# Altium schematic sheet FPGA_Power_ConnectionSchematic.SchDoc
size A3; SheetNumber: 4; SheetTotal: 10
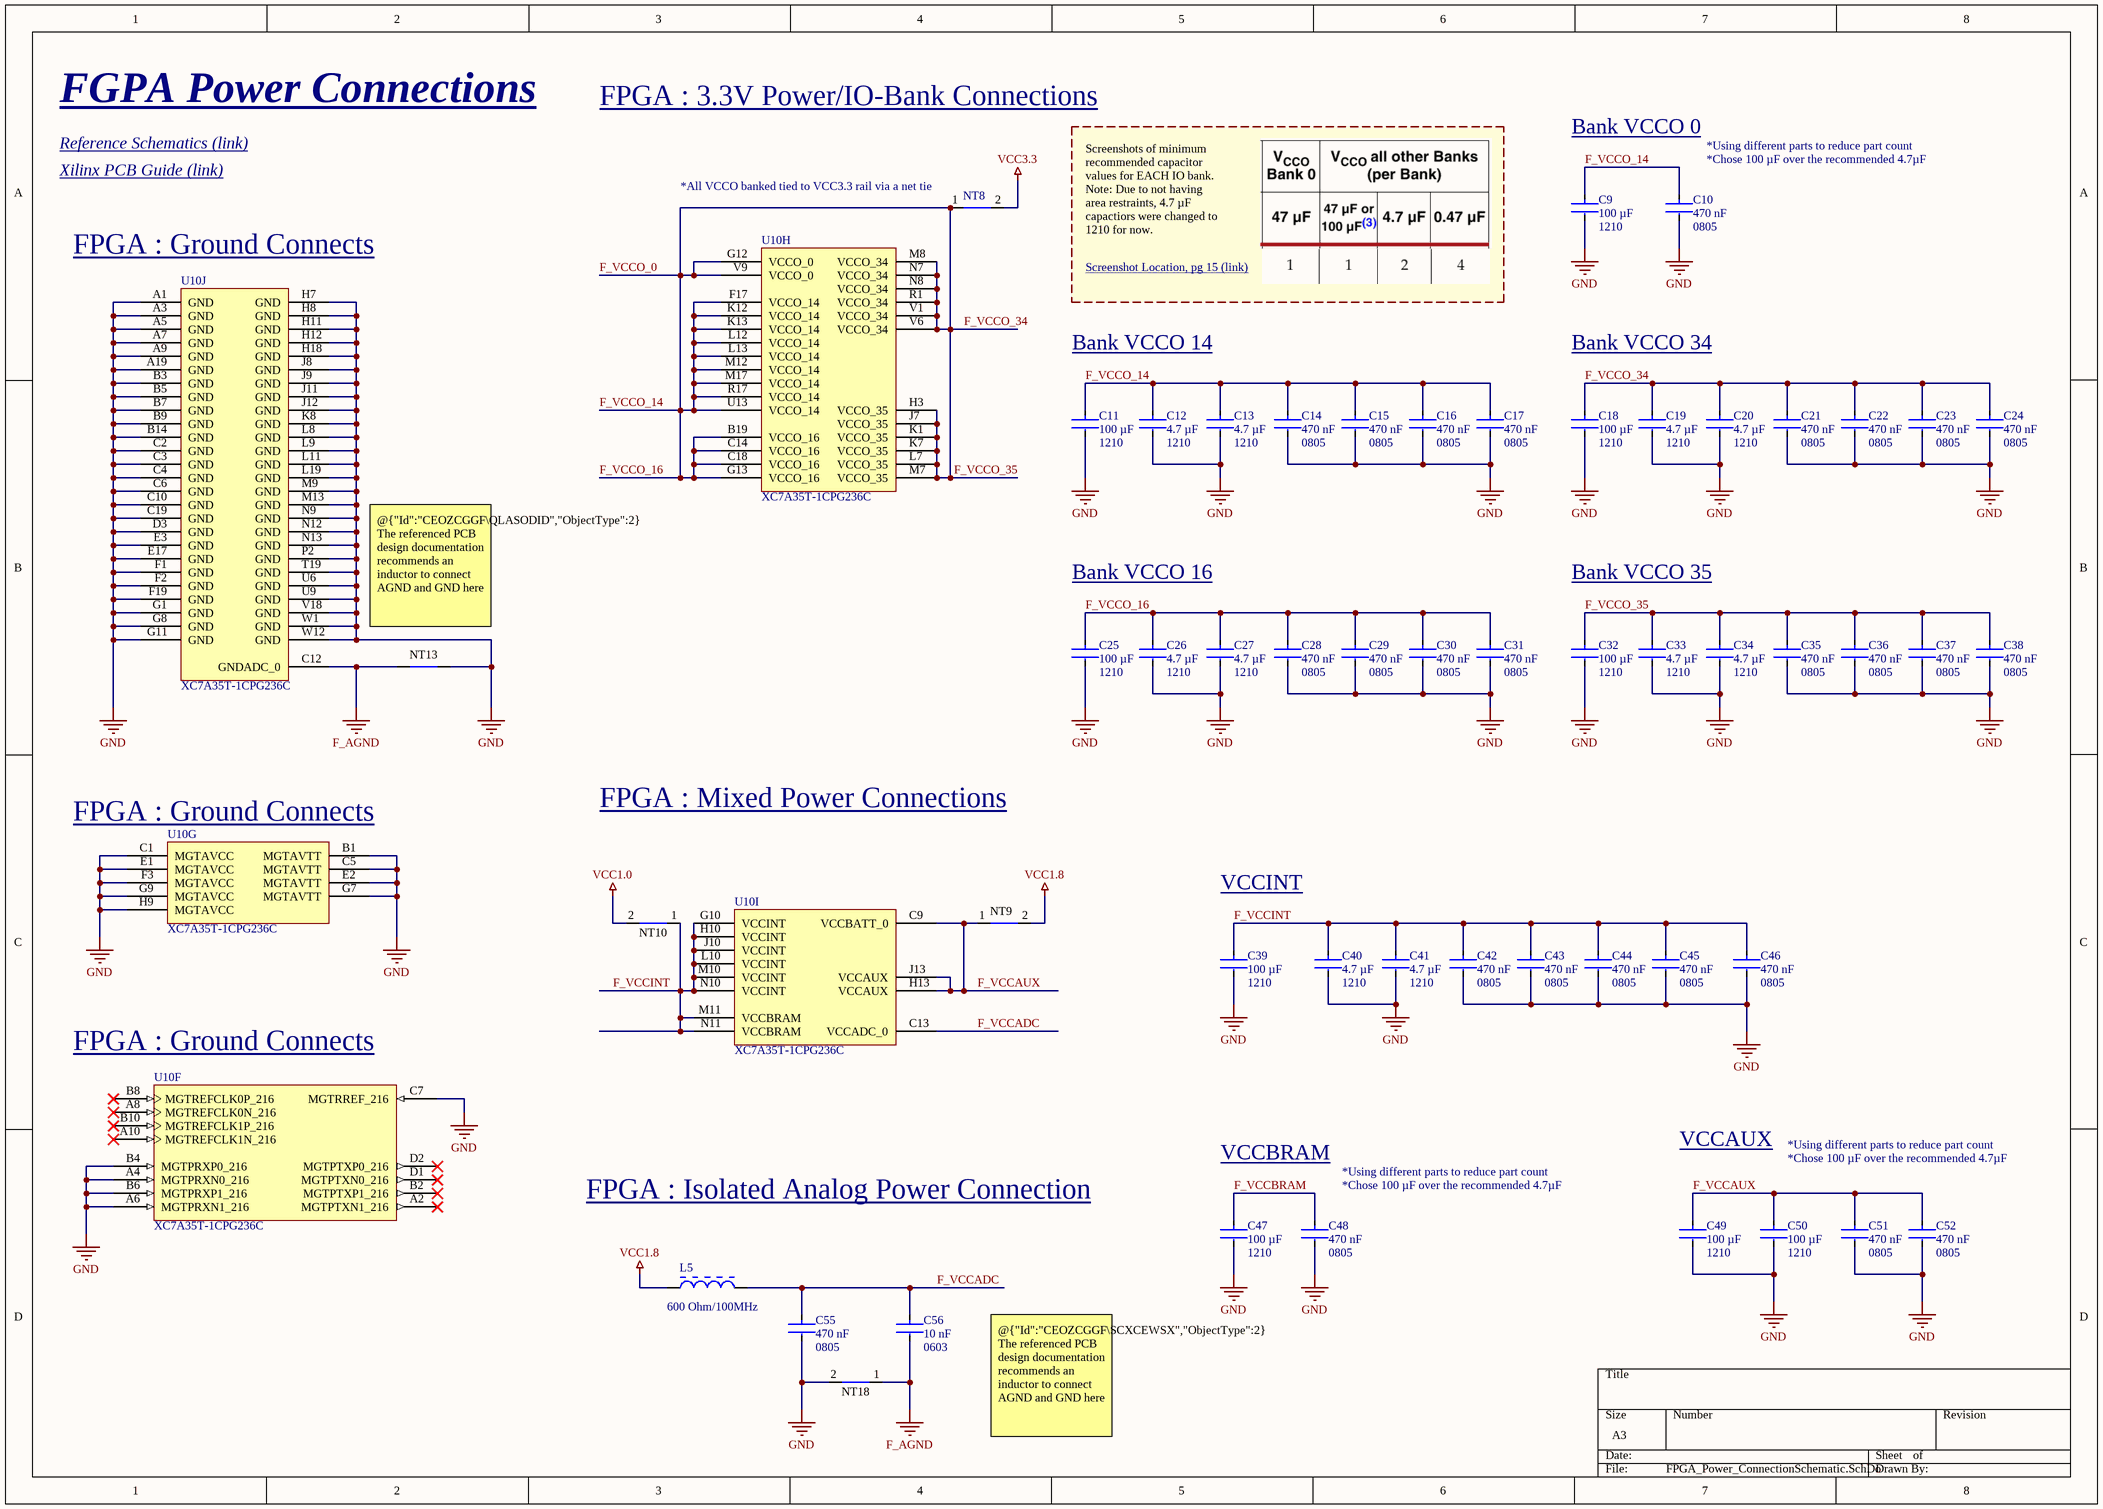
[diagram p0: FPGA_Power_ConnectionSchematic.SchDoc]

## Parts
C9  Case Code (Imperial): 1210  Capacitance: 100 µF  [FP-CL32-IPC_C]  (hidden comment: CL32A107MQVNNNE)
C10  Case Code (Imperial): 0805  Capacitance: 470 nF  [FP-CGA4J-IPC_A]  (hidden comment: CGA4J3X7R1H474M125AE)
C11  Case Code (Imperial): 1210  Capacitance: 100 µF  [FP-CL32-IPC_C]  (hidden comment: CL32A107MQVNNNE)
C12  Case/Package: 1210  Capacitance: 4.7 µF  [FP-1210-L_3_3_0_4-W_2_5_0-IPC_B]  (hidden comment: 12105C475K4Z2A)
C13  Case/Package: 1210  Capacitance: 4.7 µF  [FP-1210-L_3_3_0_4-W_2_5_0-IPC_B]  (hidden comment: 12105C475K4Z2A)
C14  Case Code (Imperial): 0805  Capacitance: 470 nF  [FP-CGA4J-IPC_A]  (hidden comment: CGA4J3X7R1H474M125AE)
C15  Case Code (Imperial): 0805  Capacitance: 470 nF  [FP-CGA4J-IPC_A]  (hidden comment: CGA4J3X7R1H474M125AE)
C16  Case Code (Imperial): 0805  Capacitance: 470 nF  [FP-CGA4J-IPC_A]  (hidden comment: CGA4J3X7R1H474M125AE)
C17  Case Code (Imperial): 0805  Capacitance: 470 nF  [FP-CGA4J-IPC_A]  (hidden comment: CGA4J3X7R1H474M125AE)
C18  Case Code (Imperial): 1210  Capacitance: 100 µF  [FP-CL32-IPC_C]  (hidden comment: CL32A107MQVNNNE)
C19  Case/Package: 1210  Capacitance: 4.7 µF  [FP-1210-L_3_3_0_4-W_2_5_0-IPC_B]  (hidden comment: 12105C475K4Z2A)
C20  Case/Package: 1210  Capacitance: 4.7 µF  [FP-1210-L_3_3_0_4-W_2_5_0-IPC_B]  (hidden comment: 12105C475K4Z2A)
C21  Case Code (Imperial): 0805  Capacitance: 470 nF  [FP-CGA4J-IPC_A]  (hidden comment: CGA4J3X7R1H474M125AE)
C22  Case Code (Imperial): 0805  Capacitance: 470 nF  [FP-CGA4J-IPC_A]  (hidden comment: CGA4J3X7R1H474M125AE)
C23  Case Code (Imperial): 0805  Capacitance: 470 nF  [FP-CGA4J-IPC_A]  (hidden comment: CGA4J3X7R1H474M125AE)
C24  Case Code (Imperial): 0805  Capacitance: 470 nF  [FP-CGA4J-IPC_A]  (hidden comment: CGA4J3X7R1H474M125AE)
C25  Case Code (Imperial): 1210  Capacitance: 100 µF  [FP-CL32-IPC_C]  (hidden comment: CL32A107MQVNNNE)
C26  Case/Package: 1210  Capacitance: 4.7 µF  [FP-1210-L_3_3_0_4-W_2_5_0-IPC_B]  (hidden comment: 12105C475K4Z2A)
C27  Case/Package: 1210  Capacitance: 4.7 µF  [FP-1210-L_3_3_0_4-W_2_5_0-IPC_B]  (hidden comment: 12105C475K4Z2A)
C28  Case Code (Imperial): 0805  Capacitance: 470 nF  [FP-CGA4J-IPC_A]  (hidden comment: CGA4J3X7R1H474M125AE)
C29  Case Code (Imperial): 0805  Capacitance: 470 nF  [FP-CGA4J-IPC_A]  (hidden comment: CGA4J3X7R1H474M125AE)
C30  Case Code (Imperial): 0805  Capacitance: 470 nF  [FP-CGA4J-IPC_A]  (hidden comment: CGA4J3X7R1H474M125AE)
C31  Case Code (Imperial): 0805  Capacitance: 470 nF  [FP-CGA4J-IPC_A]  (hidden comment: CGA4J3X7R1H474M125AE)
C32  Case Code (Imperial): 1210  Capacitance: 100 µF  [FP-CL32-IPC_C]  (hidden comment: CL32A107MQVNNNE)
C33  Case/Package: 1210  Capacitance: 4.7 µF  [FP-1210-L_3_3_0_4-W_2_5_0-IPC_B]  (hidden comment: 12105C475K4Z2A)
C34  Case/Package: 1210  Capacitance: 4.7 µF  [FP-1210-L_3_3_0_4-W_2_5_0-IPC_B]  (hidden comment: 12105C475K4Z2A)
C35  Case Code (Imperial): 0805  Capacitance: 470 nF  [FP-CGA4J-IPC_A]  (hidden comment: CGA4J3X7R1H474M125AE)
C36  Case Code (Imperial): 0805  Capacitance: 470 nF  [FP-CGA4J-IPC_A]  (hidden comment: CGA4J3X7R1H474M125AE)
C37  Case Code (Imperial): 0805  Capacitance: 470 nF  [FP-CGA4J-IPC_A]  (hidden comment: CGA4J3X7R1H474M125AE)
C38  Case Code (Imperial): 0805  Capacitance: 470 nF  [FP-CGA4J-IPC_A]  (hidden comment: CGA4J3X7R1H474M125AE)
C39  Case Code (Imperial): 1210  Capacitance: 100 µF  [FP-CL32-IPC_C]  (hidden comment: CL32A107MQVNNNE)
C40  Case/Package: 1210  Capacitance: 4.7 µF  [FP-1210-L_3_3_0_4-W_2_5_0-IPC_B]  (hidden comment: 12105C475K4Z2A)
C41  Case/Package: 1210  Capacitance: 4.7 µF  [FP-1210-L_3_3_0_4-W_2_5_0-IPC_B]  (hidden comment: 12105C475K4Z2A)
C42  Case Code (Imperial): 0805  Capacitance: 470 nF  [FP-CGA4J-IPC_A]  (hidden comment: CGA4J3X7R1H474M125AE)
C43  Case Code (Imperial): 0805  Capacitance: 470 nF  [FP-CGA4J-IPC_A]  (hidden comment: CGA4J3X7R1H474M125AE)
C44  Case Code (Imperial): 0805  Capacitance: 470 nF  [FP-CGA4J-IPC_A]  (hidden comment: CGA4J3X7R1H474M125AE)
C45  Case Code (Imperial): 0805  Capacitance: 470 nF  [FP-CGA4J-IPC_A]  (hidden comment: CGA4J3X7R1H474M125AE)
C46  Case Code (Imperial): 0805  Capacitance: 470 nF  [FP-CGA4J-IPC_A]  (hidden comment: CGA4J3X7R1H474M125AE)
C47  Case Code (Imperial): 1210  Capacitance: 100 µF  [FP-CL32-IPC_C]  (hidden comment: CL32A107MQVNNNE)
C48  Case Code (Imperial): 0805  Capacitance: 470 nF  [FP-CGA4J-IPC_A]  (hidden comment: CGA4J3X7R1H474M125AE)
C49  Case Code (Imperial): 1210  Capacitance: 100 µF  [FP-CL32-IPC_C]  (hidden comment: CL32A107MQVNNNE)
C50  Case Code (Imperial): 1210  Capacitance: 100 µF  [FP-CL32-IPC_C]  (hidden comment: CL32A107MQVNNNE)
C51  Case Code (Imperial): 0805  Capacitance: 470 nF  [FP-CGA4J-IPC_A]  (hidden comment: CGA4J3X7R1H474M125AE)
C52  Case Code (Imperial): 0805  Capacitance: 470 nF  [FP-CGA4J-IPC_A]  (hidden comment: CGA4J3X7R1H474M125AE)
C55  Case Code (Imperial): 0805  Capacitance: 470 nF  [FP-CGA4J-IPC_A]  (hidden comment: CGA4J3X7R1H474M125AE)
C56  Case Code (Imperial): 0603  Capacitance: 10 nF  [FP-0603-L_1_6_0_1-W_0_8_0-MFG]  (hidden comment: EMK107SD103KA-T)
L5  OhmAtFreq: 600 Ohm/100MHz  [BOUR-SRN3015-2_V]  (hidden comment: SRN3015-3R3M)
NT8  NetTieSMD_2Line  [NetTieSMD_2Line-Footprint-1]  (value not drawn)  (net tie, no BOM)
NT9  NetTieSMD_2Line  [NetTieSMD_2Line-Footprint-1]  (value not drawn)  (net tie, no BOM)
NT10  NetTieSMD_2Line  [NetTieSMD_2Line-Footprint-1]  (value not drawn)  (net tie, no BOM)
NT13  NetTieSMD_2Line  [NetTieSMD_2Line-Footprint-1]  (value not drawn)  (net tie, no BOM)
NT18  NetTieSMD_2Line  [NetTieSMD_2Line-Footprint-1]  (value not drawn)  (net tie, no BOM)
U10  XC7A35T-1CPG236C  [CPG236]  (parts F,G,H,I,J of 10)

## Nets
F_AGND: C56.2 NT13.1 NT18.1 U10.C12(GNDADC_0)
GND: C9.2 C10.2 C11.2 C12.2 C13.2 C14.2 C15.2 C16.2 C17.2 C18.2 C19.2 C20.2 C21.2 C22.2 C23.2 C24.2 C25.2 C26.2 C27.2 C28.2 C29.2 C30.2 C31.2 C32.2 C33.2 C34.2 C35.2 C36.2 C37.2 C38.2 C39.2 C40.2 C41.2 C42.2 C43.2 C44.2 C45.2 C46.2 C47.2 C48.2 C49.2 C50.2 C51.2 C52.2 C55.2 NT13.2 NT18.2 U10.A1(GND) U10.A3(GND) U10.A4(MGTPRXN0_216) U10.A5(GND) U10.A6(MGTPRXN1_216) U10.A7(GND) U10.A9(GND) U10.A19(GND) U10.B1(MGTAVTT) U10.B3(GND) U10.B4(MGTPRXP0_216) U10.B5(GND) U10.B6(MGTPRXP1_216) U10.B7(GND) U10.B9(GND) U10.B14(GND) U10.C1(MGTAVCC) U10.C2(GND) U10.C3(GND) U10.C4(GND) U10.C5(MGTAVTT) U10.C6(GND) U10.C7(MGTRREF_216) U10.C10(GND) U10.C19(GND) U10.D3(GND) U10.E1(MGTAVCC) U10.E2(MGTAVTT) U10.E3(GND) U10.E17(GND) U10.F1(GND) U10.F2(GND) U10.F3(MGTAVCC) U10.F19(GND) U10.G1(GND) U10.G7(MGTAVTT) U10.G8(GND) U10.G9(MGTAVCC) U10.G11(GND) U10.H7(GND) U10.H8(GND) U10.H9(MGTAVCC) U10.H11(GND) U10.H12(GND) U10.H18(GND) U10.J8(GND) U10.J9(GND) U10.J11(GND) U10.J12(GND) U10.K8(GND) U10.L8(GND) U10.L9(GND) U10.L11(GND) U10.L19(GND) U10.M9(GND) U10.M13(GND) U10.N9(GND) U10.N12(GND) U10.N13(GND) U10.P2(GND) U10.T19(GND) U10.U6(GND) U10.U9(GND) U10.V18(GND) U10.W1(GND) U10.W12(GND)
VCC1.0: NT10.2
VCC1.8: L5.2 NT9.2
VCC3.3: NT8.2
F_VCCADC: C55.1 C56.1 L5.1 U10.C13(VCCADC_0)
F_VCCAUX: C49.1 C50.1 C51.1 C52.1 NT9.1 U10.C9(VCCBATT_0) U10.H13(VCCAUX) U10.J13(VCCAUX)
F_VCCBRAM: C47.1 C48.1
F_VCCINT: C39.1 C40.1 C41.1 C42.1 C43.1 C44.1 C45.1 C46.1 NT10.1 U10.G10(VCCINT) U10.H10(VCCINT) U10.J10(VCCINT) U10.L10(VCCINT) U10.M10(VCCINT) U10.M11(VCCBRAM) U10.N10(VCCINT) U10.N11(VCCBRAM)
F_VCCO_0: C9.1 C10.1 C11.1 C12.1 C13.1 C14.1 C15.1 C16.1 C17.1 C18.1 C19.1 C20.1 C21.1 C22.1 C23.1 C24.1 C25.1 C26.1 C27.1 C28.1 C29.1 C30.1 C31.1 C32.1 C33.1 C34.1 C35.1 C36.1 C37.1 C38.1 NT8.1 U10.B19(VCCO_16) U10.C14(VCCO_16) U10.C18(VCCO_16) U10.F17(VCCO_14) U10.G12(VCCO_0) U10.G13(VCCO_16) U10.H3(VCCO_35) U10.J7(VCCO_35) U10.K1(VCCO_35) U10.K7(VCCO_35) U10.K12(VCCO_14) U10.K13(VCCO_14) U10.L7(VCCO_35) U10.L12(VCCO_14) U10.L13(VCCO_14) U10.M7(VCCO_35) U10.M8(VCCO_34) U10.M12(VCCO_14) U10.M17(VCCO_14) U10.N7(VCCO_34) U10.N8(VCCO_34) U10.R1(VCCO_34) U10.R17(VCCO_14) U10.U13(VCCO_14) U10.V1(VCCO_34) U10.V6(VCCO_34) U10.V9(VCCO_0)  [also labelled F_VCCO_14, F_VCCO_16, F_VCCO_34, F_VCCO_35]

Not connected (* = marked no-connect by the designer): U10 A2(MGTPTXN1_216)* A8(MGTREFCLK0N_216)* A10(MGTREFCLK1N_216)* B2(MGTPTXP1_216)* B8(MGTREFCLK0P_216)* B10(MGTREFCLK1P_216)* D1(MGTPTXN0_216)* D2(MGTPTXP0_216)*

## Notes on the sheet
- FGPA Power Connections
- FPGA : 3.3V Power/IO-Bank Connections
- Reference Schematics (link) <https://digilent.com/reference/_media/reference/programmable-logic/cmod-a7/cmod_a7_sch_rev_c0.pdf?_gl=1*m8eg3n*_gcl_au*MjAxOTQ5MDM5OS4xNzQ2MzA4ODg3*_ga*MTA3MTgyNDA3MS4xNzQ0ODY4ODUx*_ga_JSPEFFCPBT*czE3NDY1MDUzMjQkbzIkZzEkdDE3NDY1MDUzMzQkajUwJGwwJGgzMzYwMDM3MjE.>
- Xilinx PCB Guide (link) <https://0x04.net/~mwk/xidocs/ug/xc7-pcb.pdf>
- Bank VCCO 0
- (near C10) *Chose 100 µF over the recommended 4.7µF
- *Using different parts to reduce part count
- (near NT8) *All VCCO banked tied to VCC3.3 rail via a net tie
- Screenshots of minimum recommended capacitor values for EACH IO bank.
  Note: Due to not having area restraints, 4.7 µF capactiors were changed to 1210 for now.
- (near U10) FPGA : Ground Connects
- Screenshot Location, pg 15 (link) <https://0x04.net/~mwk/xidocs/ug/xc7-pcb.pdf>
- Bank VCCO 14
- Bank VCCO 34
- Bank VCCO 16
- Bank VCCO 35
- (near NT13) @{"Id":"CEOZCGGF\QLASODID","ObjectType":2} The referenced PCB design documentation recommends an inductor to connect AGND and GND here
- FPGA : Mixed Power Connections
- VCCINT
- VCCBRAM
- (near C48) *Chose 100 µF over the recommended 4.7µF
- VCCAUX
- *Chose 100 µF over the recommended 4.7µF
- FPGA : Isolated Analog Power Connection
- @{"Id":"CEOZCGGF\SCXCEWSX","ObjectType":2} The referenced PCB design documentation recommends an inductor to connect AGND and GND here

## Library data of the parts
C9 C11 C18 C25 C32 C39 C47 C49 C50 = CMP-13271-001330-1: CAP CER 100UF 6.3V X5R 1210; Tolerance: 20%; Material: Ceramic; Voltage: 6.3V; Voltage Rating (DC): 6.3V; Length: 3.2mm; Width: 0.098inch; Thickness: 0.11inch; Dielectric: X5R; Packaging: Tape and Reel; Voltage Rating: 6.3V; Min Operating Temperature: -55°C; Lead Free: Lead Free; Radiation Hardening: No; Height: 2.5mm; Depth: 2.5mm; Case Code (Metric): 3225; Mount: Surface Mount; Package Quantity: 1; Case/Package: 1210; Max Operating Temperature: 85°C; Contact Plating: Tin
C10 C14-C17 C21-C24 C28-C31 C35-C38 C42-C46 C48 C51 C52 C55 = CMP-08246-001744-1: Cap Ceramic 470nF 50V X7R 20% Pad SMD 0805 +125°C Automotive T/R; Length: 2mm; Depth: 1.25mm; Features: Soft Termination; Case Code (Metric): 2012; Max Operating Temperature: 125°C; Tolerance: 20%; Termination: SMD/SMT; Mount: Surface Mount; Voltage Rating (DC): 50V; Dielectric: X7R; Thickness: 0.049inch; Width: 0.049inch; Min Operating Temperature: -55°C; Packaging: Tape and Reel; Height: 1.25mm; REACH SVHC: No SVHC; Package Quantity: 1; Weight: 0.000194oz; Case/Package: 0805; Ratings: AEC-Q200; Voltage Rating: 50V
C12 C13 C19 C20 C26 C27 C33 C34 C40 C41 = CMP-04427-013061-1: Automotive Ceramic Capacitor, 1210, 4.7uF, 10%, X7R, 15%, 50V; Dissipation Factor: 2.5%; Length: 3.2mm; Termination: SMD/SMT; Height: 2.79mm; Package Quantity: 1; Tolerance: 10%; Lead Free: Lead Free; Max Operating Temperature: 125°C; Number of Pins: 2; Voltage Rating (DC): 50V; Depth: 2.5mm; REACH SVHC: No SVHC; Series: FLEXITERM®; Construction: Flat; RoHS Compliant: Yes; Thickness: 0.11inch; Dielectric: X7R; Width: 0.098inch; Mount: Surface Mount; Packaging: Tape and Reel; Features: Soft Termination; Case Code (Metric): 3225; Voltage Rating: 50V; Case Code (Imperial): 1210; Min Operating Temperature: -55°C; Contact Plating: Tin; Ratings: AEC-Q200; Radiation Hardening: No
C56 = CMP-14477-001835-2: None; Voltage Rating (DC): 16V; Tolerance: 10%; Mount: Surface Mount; Lead Free: Lead Free; Min Operating Temperature: -55°C; Resistor Type: Ceramic; Voltage Rating: 16V; Package Quantity: 1; RoHS Compliant: Yes; Case/Package: 0603; Length: 1.6mm; Radiation Hardening: No; Halogen Free: Halogen Free; Max Operating Temperature: 125°C; Thickness: 0.035inch; Termination: SMD/SMT; Case Code (Metric): 1608; Packaging: Tape and Reel; Weight: 7.1E-05oz; Width: 0.031inch; Construction: Flat; Height: 0.8mm; Depth: 0.8mm; Series: CFCAP™
L5 = CMP-0007-00001-1: Semi-shielded Power Inductor, 3.3 uH, +/- 20%, 1.6 A, -40 to 125 degC, 3 x 3 x 1.5 mm SMD, RoHS and Halogen Free, Tape and Reel; Manufacturer: Bourns; DCR Max: 0.112 Ohm; Resistance to Solder Heat: +260 degC for 10 sec.; Inductance: 3.3 uH; Rated current: 1.6 A; SRF Min: 75 MHz; Isat: 1.4 A; Inductance tolerance: +/- 20%; PackageDescription: 2-Pin SMD, Body 3 x 3 mm, Height 1.5 mm; ComponentLink1URL: http://www.bourns.com/; ComponentLink3URL: http://www.bourns.com/data/global/pdfs/SRN3015.pdf; RoHS: TRUE; ComponentLink2URL: http://www.bourns.com/data/global/pdfs/SRN3015.pdf; DatasheetVersion: Aug-11; ComponentLink3Description: Package Specification; PartNumber: SRN3015-3R3M; ComponentLink2Description: Datasheet; Packing: Tape and Reel; ComponentLink1Description: Manufacturer URL; Mounting Technology: Surface Mount; PackageReference: SRN3015; Operating Temperature: -40 to 125 degC
NT8 = CMP-00028-00008-4: Net tie for a small straigth net tie.
NT9 NT10 NT13 NT18 = CMP-00028-00008-1: Net tie for a small straigth net tie.
U10 = CMP-0383-00006-1: Artix-7 FPGA, 106 User I/Os, 2 GTP, 238-Ball BGA, Speed Grade 1, Commercial Grade, Pb-Free; Manufacturer: Xilinx; CMTs: 5; Total Block RAM: 1800 Kb; Logic Cells: 33280; Speed Grades: 1; GTP: 2; Available User I/O: 106; ComponentLink1URL: http://www.xilinx.com/; Maximum Distributed RAM: 400 Kb; PackageVersion: Rev. 1.11; PartNumber: XC7A35T-1CPG236C; ComponentLink2URL: http://www.xilinx.com/support/documentation/data_sheets/ds180_7Series_Overview.pdf; DatasheetVersion: Rev. 1.15; ComponentLink1Description: Manufacturer URL; ComponentLink3Description: Pinout; ComponentLink4Description: Package Specification; Mounting Technology: Surface Mount; PackageReference: CPG-236; Operating Temperature Range: Commercial; PackageDescription: 238-Ball Wire-Bond Chip-Scale BGA, Body 10 x10 mm, Pitch 0.5 mm; ComponentLink3URL: http://www.xilinx.com/support/documentation/user_guides/ug475_7Series_Pkg_Pinout.pdf; ComponentLink4URL: http://www.xilinx.com/support/documentation/user_guides/ug475_7Series_Pkg_Pinout.pdf; ComponentLink2Description: Datasheet